# Altium schematic sheet 01_MAIN.SchDoc: =GlobalProjectName
size 594 x 420 mm; CheckedBy: A_D; Author: A_D; SheetNumber: 1; SheetTotal: 3; PageSetup: Record=PageOptions|CenterHorizontal=True|CenterVertical=True|PrintScale=0.70|XCorrection=1.00|YCorrection=1.00|PrintKind=2|BorderSize=5000000|LeftOffset=9000|BottomOffset=10100|Orientation=2|PaperLength=11176|PaperWidth=8636|Scale=100|PaperSource=259|PrintQuality=-3|MediaType=1|DitherType=10|PrintScaleMode=1|PaperKind=A3|PaperIndex=8
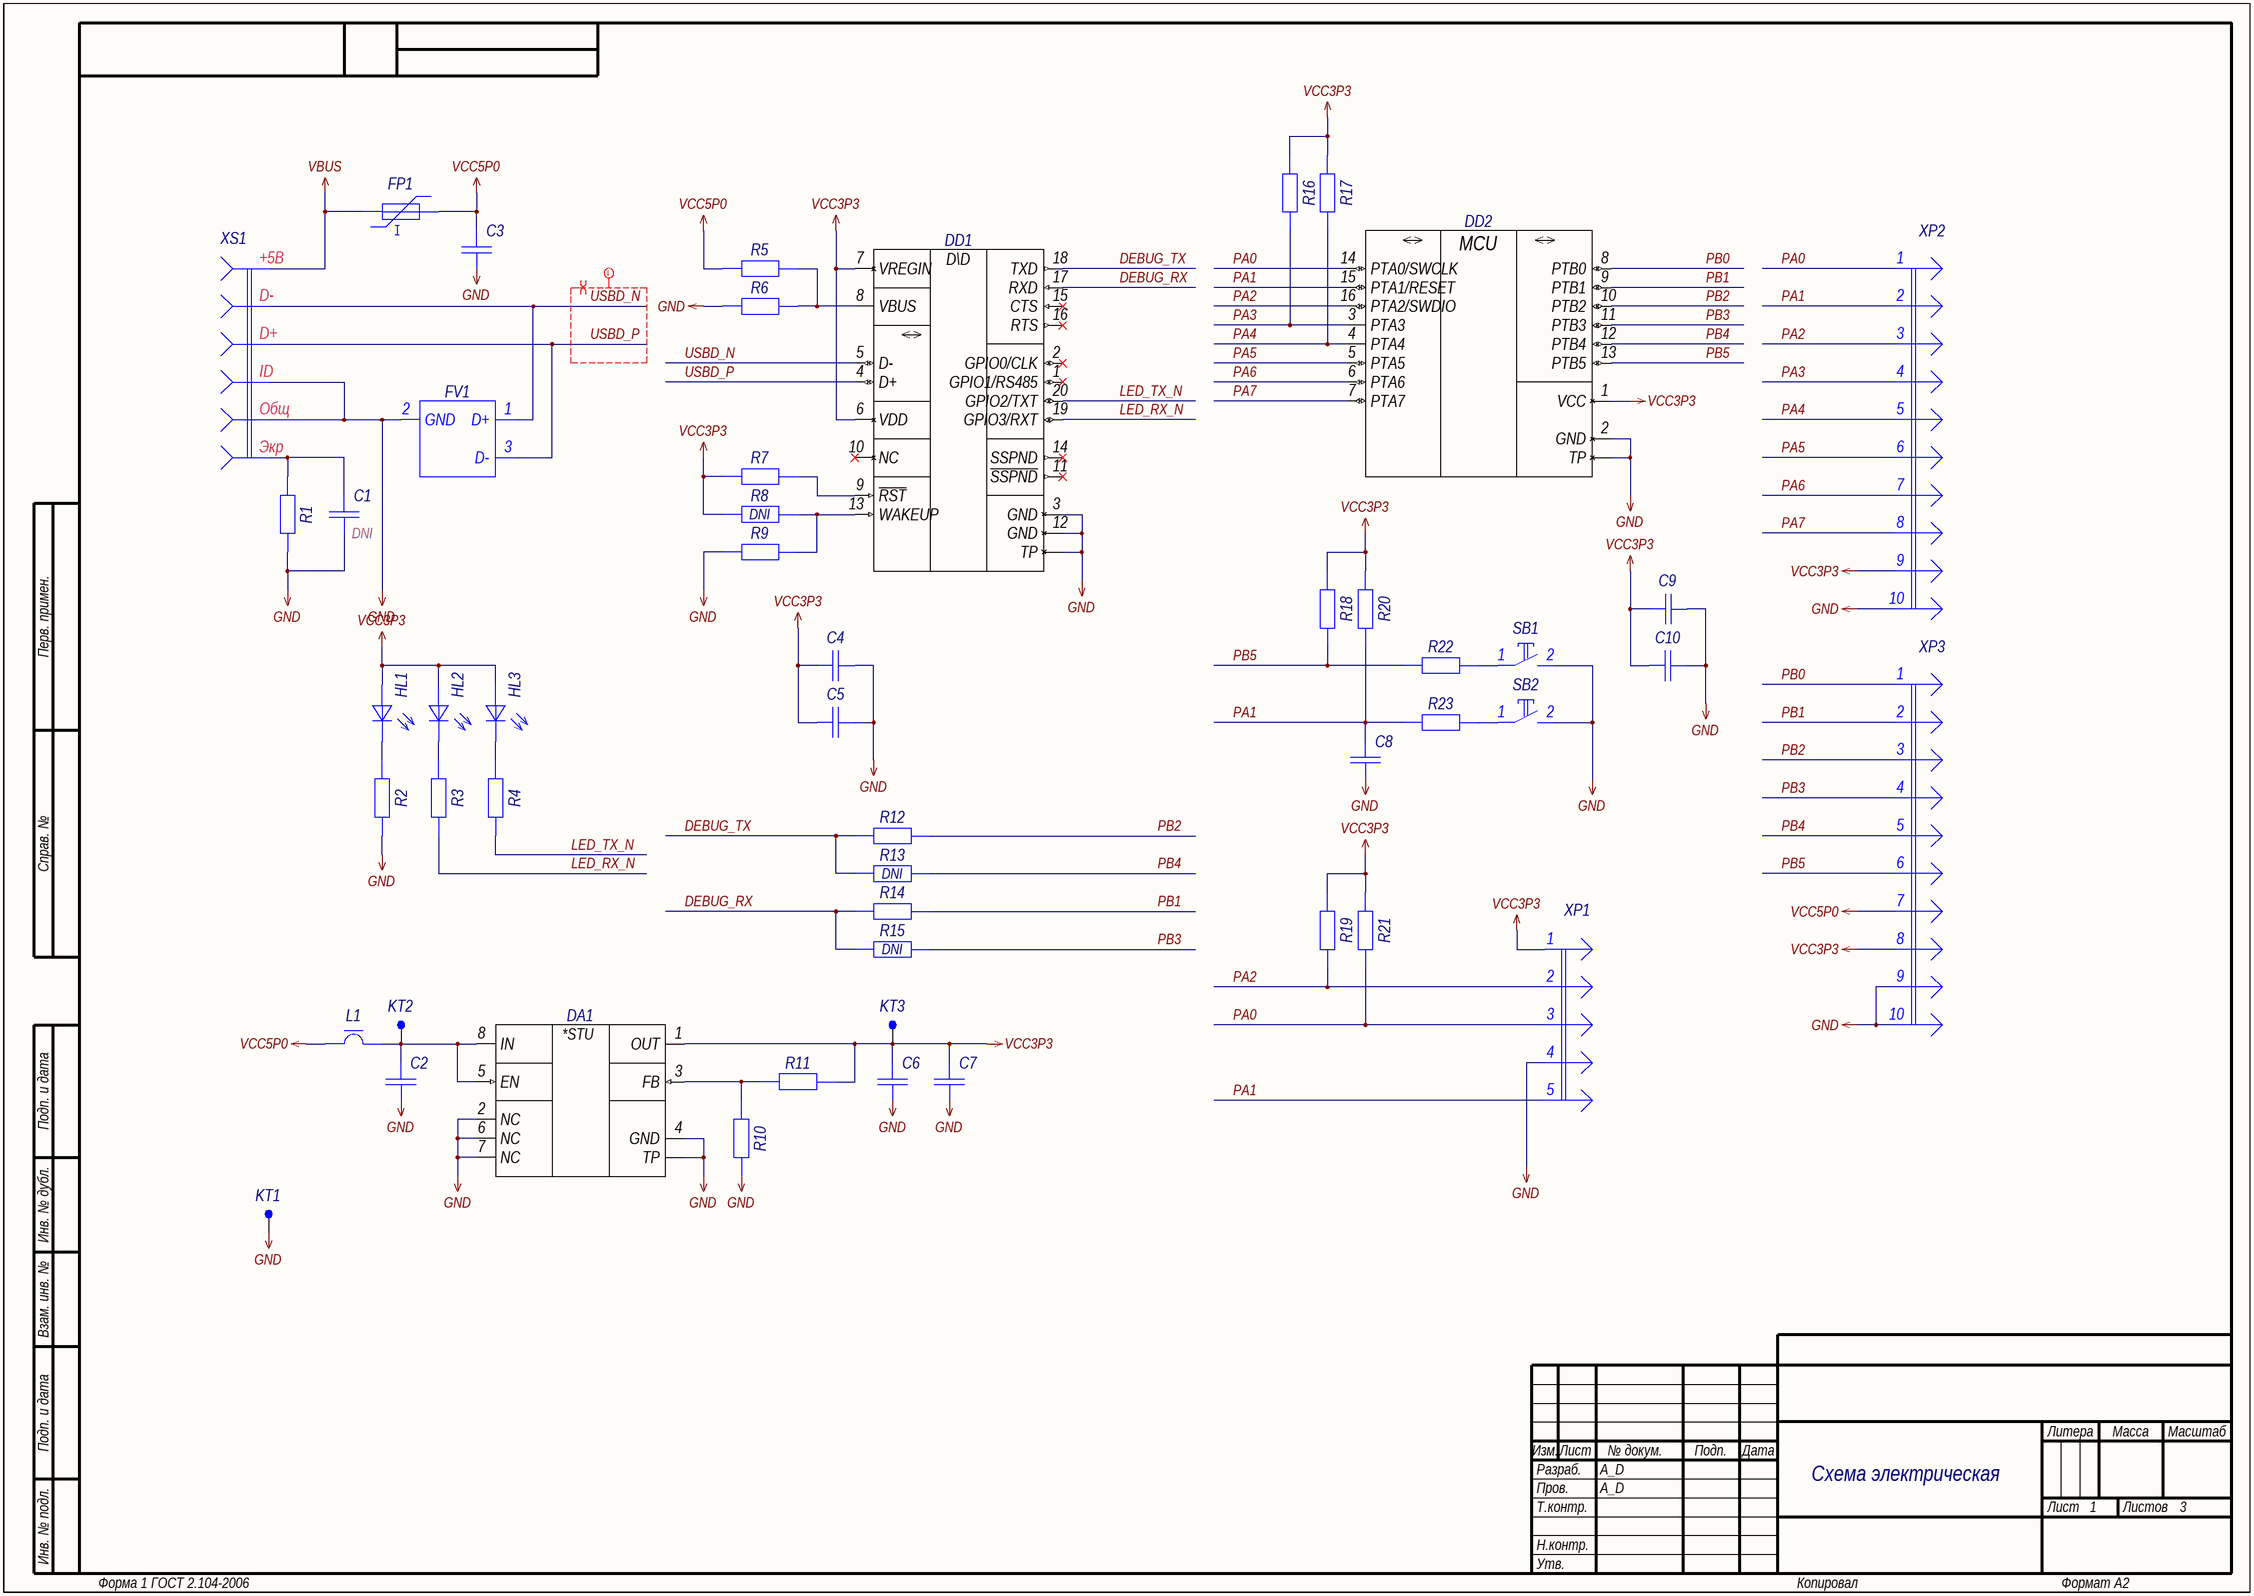
[diagram p0: 01_MAIN.SchDoc]

## Parts
C1  Capacitor  [C0603_L]  (value not drawn)  (no BOM)
C2  Capacitor  [C0402_L]  (value not drawn)
C3  Capacitor  [C0603_L]  (value not drawn)
C4  Capacitor  [C0402_L]  (value not drawn)
C5  Capacitor  [C0402_L]  (value not drawn)
C6  Capacitor  [C0402_L]  (value not drawn)
C7  Capacitor  [C0402_L]  (value not drawn)
C8  Capacitor  [C0402_L]  (value not drawn)
C9  Capacitor  [C0402_L]  (value not drawn)
C10  Capacitor  [C0402_L]  (value not drawn)
DA1  TPS73701DRB  [VSON-8_065P300X300X100_N]  (value not drawn)
DD1  CP2102N-xxx-GQFN20  [QFN-20_050P300X300X080_N]  (value not drawn)
DD2  MKL03ZxxVFG4-Series  [HUQFN-16_050P300X300X065_N]  (value not drawn)
FP1  Fuse_PTC  [F0603_L]  (value not drawn)
FV1  TPD2EUSB30DRT  [SOT-3_070P100X080X050_N]  (value not drawn)
HL1  (no value)  [LD0402_L]
HL2  (no value)  [LD0402_L]
HL3  (no value)  [LD0402_L]
KT1  Text  [TP-SMT-R-0.8mm]  (value not drawn)  (no BOM)
KT2  Text  [TP-SMT-C-0.5mm]  (value not drawn)  (no BOM)
KT3  Text  [TP-SMT-C-0.5mm]  (value not drawn)  (no BOM)
L1  FerriteBead  [L0402_L]  (value not drawn)
R1  Resistor  [R0603_L]  (value not drawn)
R2  Resistor  [R0402_L]  (value not drawn)
R3  Resistor  [R0402_L]  (value not drawn)
R4  Resistor  [R0402_L]  (value not drawn)
R5  Resistor  [R0402_L]  (value not drawn)
R6  Resistor  [R0402_L]  (value not drawn)
R7  Resistor  [R0402_L]  (value not drawn)
R8  Resistor  [R0402_L]  (value not drawn)  (no BOM)
R9  Resistor  [R0402_L]  (value not drawn)
R10  Resistor  [R0402_L]  (value not drawn)
R11  Resistor  [R0402_L]  (value not drawn)
R12  Resistor  [R0402_L]  (value not drawn)
R13  Resistor  [R0402_L]  (value not drawn)  (no BOM)
R14  Resistor  [R0402_L]  (value not drawn)
R15  Resistor  [R0402_L]  (value not drawn)  (no BOM)
R16  Resistor  [R0402_L]  (value not drawn)
R17  Resistor  [R0402_L]  (value not drawn)
R18  Resistor  [R0402_L]  (value not drawn)
R19  Resistor  [R0402_L]  (value not drawn)
R20  Resistor  [R0402_L]  (value not drawn)
R21  Resistor  [R0402_L]  (value not drawn)
R22  Resistor  [R0402_L]  (value not drawn)
R23  Resistor  [R0402_L]  (value not drawn)
SB1  RESET  [IT-1185AP]  (value not drawn)
SB2  NMI  [IT-1185AP]  (value not drawn)
XP1  Text  [PLS-5]  (value not drawn)
XP2  PA  [PLS-10]  (value not drawn)
XP3  PB  [PLS-10]  (value not drawn)
XS1  USB  [1981568-1]  (value not drawn)

## Nets
GND: C1.1 C2.1 C3.1 C4.1 C5.1 C6.1 C7.1 C8.2 C9.2 C10.1 DA1.2(NC) DA1.4(GND) DA1.6(NC) DA1.7(NC) DA1.TP DD1.3(GND) DD1.12(GND) DD1.TP DD2.2(GND) DD2.TP FV1.2(GND) KT1.1 R1.1 R2.1 R6.1 R9.1 R10.1 SB1.2 SB2.2 XP1.4 XP2.10 XP3.9 XP3.10 XS1.4 XS1.5
VBUS: FP1.1 XS1.1
VCC3P3: C4.2 C5.2 C6.2 C7.2 C9.1 C10.2 DA1.1(OUT) DD1.6(VDD) DD1.7(VREGIN) DD2.1(VCC) HL1.1(А) HL2.1(А) HL3.1(А) KT3.1 R7.2 R8.2 R11.2 R16.2 R17.2 R18.1 R19.1 R20.1 R21.1 XP1.1 XP2.9 XP3.8
VCC5P0: C3.2 FP1.2 L1.1 R5.1 XP3.7
DEBUG_RX: DD1.17(RXD) R14.1 R15.1
DEBUG_TX: DD1.18(TXD) R12.1 R13.1
LED_RX_N: DD1.19(GPIO3/RXT) R3.1
LED_TX_N: DD1.20(GPIO2/TXT) R4.1
PA0: DD2.14(PTA0/SWCLK) R21.2 XP1.3 XP2.1
PA1: C8.1 DD2.15(PTA1/RESET) R20.2 R23.1 XP1.5 XP2.2
PA2: DD2.16(PTA2/SWDIO) R19.2 XP1.2 XP2.3
PA3: DD2.3(PTA3) R16.1 XP2.4
PA4: DD2.4(PTA4) R17.1 XP2.5
PA5: DD2.5(PTA5) XP2.6
PA6: DD2.6(PTA6) XP2.7
PA7: DD2.7(PTA7) XP2.8
PB0: DD2.8(PTB0) XP3.1
PB1: DD2.9(PTB1) R14.2 XP3.2
PB2: DD2.10(PTB2) R12.2 XP3.3
PB3: DD2.11(PTB3) R15.2 XP3.4
PB4: DD2.12(PTB4) R13.2 XP3.5
PB5: DD2.13(PTB5) R18.2 R22.1 XP3.6
USBD_N: DD1.5(D-) FV1.1(D+) XS1.2
USBD_P: DD1.4(D+) FV1.3(D-) XS1.3
NetC1_2: C1.2 R1.2 XS1.6
NetC2_2: C2.2 DA1.5(EN) DA1.8(IN) KT2.1 L1.2
NetDA1_3: DA1.3(FB) R10.2 R11.1
NetDD1_8: DD1.8(VBUS) R5.2 R6.2
NetDD1_9: DD1.9(~{RST}) R7.1
NetDD1_13: DD1.13(WAKEUP) R8.1 R9.2
NetHL1_2: HL1.2(К) R2.2
NetHL2_2: HL2.2(К) R3.2
NetHL3_2: HL3.2(К) R4.2
NetR22_2: R22.2 SB1.1
NetR23_2: R23.2 SB2.1

Not connected (* = marked no-connect by the designer): DD1 1(GPIO1/RS485)* 2(GPIO0/CLK)* 10(NC)* 11(~{SSPND})* 14(SSPND)* 15(CTS)* 16(RTS)*

## Layout directives
differential pair; differential pair class USB: USBD_N, USBD_P
rule Matched Net Lengths [Tolerance = 1mm]: USBD_N, USBD_P

## Notes on the sheet
- (near C1) DNI
- (near R8) DNI
- (near R13) DNI
- (near R15) DNI
- Схема электрическая
  принципиальная
- Перв. примен.
- Справ. №
- Подп. и дата
- Инв. № дубл.
- Взам. инв. №
- Разраб.
- Изм.
- Лист
- № докум.
- Подп.
- Дата
- Литера
- Масса
- Масштаб
- Пров.
- Т.контр.
- Листов
- Инв. № подл.
- Н.контр.
- Утв.
- Форма 1 ГОСТ 2.104-2006
- Копировал
- Формат А2
- (in symbol 1981568-1) +5В; D-; D+; ID; Общ; Экр
- (in symbol CP2102N-A01-GQFN20) D\D
- (in symbol MKL03Z8VFG4) MCU
- (in symbol TPS73701DRBR) *STU

## Library data of the parts
C1 = GRM188R72A104KA35D: Manufacturer: Murata; Type: Конденсатор; ID: 232; Value: 0.1uF; Voltage: 100V; Tolerance: ±10%; Dielectric Type: X7R; Application Category: 1; Working Temperature Min: -55°С; Working Temperature Max: +125°С; Published: 18.05.2010; Publisher: Andrew Danich; Part Number: GRM188R72A104KA35D; Footprint: 0603; ClassName: DirectConnect
C2 C4-C7 = GRM155R60J475ME87D: Manufacturer: Murata; Type: Конденсатор; ID: 223; Value: 4.7uF; Voltage: 6.3V; Tolerance: ±20%; Dielectric Type: X5R; Application Category: 1; Working Temperature Min: -55°С; Working Temperature Max: +85°С; Published: 18.05.2010; Publisher: Andrew Danich; Part Number: GRM155R60J475ME87D; Footprint: 0402; ClassName: DirectConnect
C3 = GRM188R60J106ME47D: Manufacturer: Murata; Type: Конденсатор; ID: 136; Value: 10uF; Voltage: 6.3V; Tolerance: ±20%; Dielectric Type: X5R; Application Category: 1; Working Temperature Min: -55°С; Working Temperature Max: +85°С; Published: 18.05.2010; Publisher: Andrew Danich; Part Number: GRM188R60J106ME47D; Footprint: 0603; ClassName: DirectConnect
C8 C10 = GCM155R71C104KA55D: Manufacturer: Murata; Type: Конденсатор; ID: 163; Value: 0.1uF; Voltage: 16V; Tolerance: ±10%; Dielectric Type: X7R; Application Category: 1; Working Temperature Min: -55°С; Working Temperature Max: +125°С; Functional Analog: GRM155R71C104KA88D; Published: 18.05.2010; Publisher: Andrew Danich; Part Number: GCM155R71C104KA55D; Footprint: 0402
C9 = GRM155C71A105KE11D: Manufacturer: Murata; Type: Конденсатор; ID: 179; Value: 1uF; Voltage: 10V; Tolerance: ±10%; Dielectric Type: X7S; Application Category: 1; Working Temperature Min: -55°С; Working Temperature Max: +125°С; Published: 18.05.2010; Publisher: Andrew Danich; Part Number: GRM155C71A105KE11D; Footprint: 0402
DA1 = TPS73701DRBR: Manufacturer: Texas Instruments; ID: 26; Input Voltage: +2.2…5.5V; Output Current: 1A; Output Voltage: +1.2…5.5V; Application Category: 1; Working Temperature Min: -40°С; Working Temperature Max: +125°С; Functional Analog: TPS73701DRBT; Published: 25.03.2019; Publisher: Andrew Danich; Type: Микросхема; Part Number: TPS73701DRBR; Value: TPS73701DRBR; ClassName: DirectConnect
DD1 = CP2102N-A01-GQFN20: Manufacturer: Silicon Labs; ID: 14; Supply Operation: +3.0…3.6V; Supply Current: 13.7mA; USB Type Support: USB 2.0; USB Speed Support: 12 Mb/s; OTG Support: No; Input Interface: UART; Channels: 1; Working Temperature Min: -40°C; Working Temperature Max: +85°C; Functional Analog: CP2102N-A02-GQFN20; Published: 16.07.2019; Publisher: Andrew Danich; Type: Микросхема; Part Number: CP2102N-A01-GQFN20; Value: CP2102N-A01-GQFN20; Application Category: 1
DD2 = MKL03Z8VFG4: Manufacturer: NXP Semiconductors; ID: 29; Supply Operation: +1.71…3.6V; Flash: 8K; SRAM: 2K; Prog Interface: SWD; I/O Lines: 14; Operation Frequency: 48MHz; Application Category: 1; Working Temperature Min: -40°С; Working Temperature Max: +105°С; Published: 16.07.2019; Publisher: Andrew Danich; Type: Микросхема; Part Number: MKL03Z8VFG4; Value: MKL03Z8VFG4; EEPROM: -
FP1 = 0603L100SLYR: Manufacturer: Littelfuse; ID: 13; Limit Voltage: 6V; Rated Current: 1A; Resistance: 0.12ohm; Application Category: 1; Working Temperature Min: -40°С; Working Temperature Max: +85°С; Published: 25.0.2017; Value: 0603L100SLYR; Type: Предохранитель самовосстанавливающийся; Part Number: 0603L100SLYR; Footprint: F0603; Functional Analog: -; ClassName: DirectConnect
FV1 = TPD2EUSB30DRT: Manufacturer: Texas Instruments; ID: 5; Breakdown Voltage: 7V; Reverse Stand Off Voltage: 5.5V; Forward Voltage: 0.95V; Peak Forward Current: 5A; Junction Capacitance: 0.8pF; Pulse Power Dissipation: 45W; Directional: Bidirectional; Application Category: 1; Working Temperature Min: -40°С; Working Temperature Max: +85°С; Published: 27.12.2015; Publisher: Andrew Danich; Type: Супрессор; Part Number: TPD2EUSB30DRT; Value: TPD2EUSB30DRT; Functional Analog: -
HL1 = KPHHS-1005QBC-D-V: Manufacturer: Kingbright; Type: Индикатор единичный; ID: 24; Forward Voltage: 3.3V; Forward Current: 20mA; Power Dissipation: 120mW; Luminous Flux: 60; Color: Blue; Leds: 1; Working Temperature Min: -40°С; Working Temperature Max: +85°С; Published: 03.12.2013; Publisher: Andrew Danich; Part Number: KPHHS-1005QBC-D-V; Value: KPHHS-1005QBC-D-V; Footprint: 0402; Application Category: 1
HL2 = KPHHS-1005CGCK: Manufacturer: Kingbright; Type: Индикатор единичный; ID: 25; Forward Voltage: 2.1V; Forward Current: 20mA; Power Dissipation: 75mW; Luminous Flux: 60; Color: Green; Leds: 1; Working Temperature Min: -40°С; Working Temperature Max: +85°С; Published: 03.12.2013; Publisher: Andrew Danich; Part Number: KPHHS-1005CGCK; Value: KPHHS-1005CGCK; Footprint: 0402; Application Category: 1
HL3 = KPHHS-1005SURCK: Manufacturer: Kingbright; Type: Индикатор единичный; ID: 35; Forward Voltage: 2.5V; Forward Current: 20mA; Power Dissipation: 75mW; Luminous Flux: 140; Color: Red; Leds: 1; Working Temperature Min: -40°С; Working Temperature Max: +85°С; Published: 03.12.2013; Publisher: Andrew Danich; Part Number: KPHHS-1005SURCK; Value: KPHHS-1005SURCK; Footprint: 0402; Application Category: 1
KT1 = TestPoint-SMT-GND: ID: 7; Application Type: On PCB Test Point; Application Category: 1; Published: 03.03.2015; Publisher: Andrew Danich; Part Number: TestPoint-SMT-GND; Value: TestPoint-SMT; Manufacturer: -; Functional Analog: -
KT2 KT3 = TestPoint-SMT: ID: 6; Application Type: On PCB Test Point; Application Category: 1; Published: 03.03.2015; Publisher: Andrew Danich; Part Number: TestPoint-SMT; Value: TestPoint-SMT; Manufacturer: -; Functional Analog: -
L1 = BLM15PD121SN1D: Manufacturer: Murata; Type: Дроссель; ID: 11; Rated Current: 1.3A; Impedance at 100Mhz: 120ohm; Tolerance: ±25%; DC Resistance: 0.09ohm; Inductor Type: EMIFIL; Application Category: 1; Working Temperature Min: -55°С; Working Temperature Max: +125°С; Published: 14.11.2014; Publisher: Andrew Danich; Part Number: BLM15PD121SN1D; Value: BLM15PD121SN1D; Footprint: 0402; ClassName: DirectConnect
R1 = RC0603JR-070R: Manufacturer: Yageo; ID: 5; Value: 0; Limit Voltage: 50V; Tolerance: ±5%; Temperature Coefficient: 100ppm; Total Power Dissipation: 0.1W; Series Type: Thick-Film; Application Category: 1; Working Temperature Min: -55°С; Working Temperature Max: +155°С; Functional Analog: RC0603FR-070RL, CR0603-J/-000E; Published: 24.03.2010; Publisher: Andrew Danich; Type: Резистор; Part Number: RC0603JR-070R; Footprint: 0603; ClassName: DirectConnect
R2-R4 = RC0402JR-071KL: Manufacturer: Yageo; ID: 3; Value: 1k; Limit Voltage: 50V; Tolerance: ±5%; Temperature Coefficient: 100ppm; Total Power Dissipation: 0.1W; Series Type: Thick-Film; Application Category: 1; Working Temperature Min: -55°С; Working Temperature Max: +155°С; Published: 24.03.2010; Publisher: Andrew Danich; Type: Резистор; Part Number: RC0402JR-071KL; Footprint: 0402
R5 R11 = RC0402FR-0722K1L: Manufacturer: Yageo; ID: 447; Value: 22.1k; Limit Voltage: 50V; Tolerance: ±1%; Temperature Coefficient: 100ppm; Total Power Dissipation: 0.1W; Series Type: Thick-Film; Application Category: 1; Working Temperature Min: -55°С; Working Temperature Max: +155°С; Published: 24.03.2010; Publisher: Andrew Danich; Type: Резистор; Part Number: RC0402FR-0722K1L; Footprint: 0402
R6 = RC0402FR-0747KL: Manufacturer: Yageo; ID: 528; Value: 47k; Limit Voltage: 50V; Tolerance: ±1%; Temperature Coefficient: 100ppm; Total Power Dissipation: 0.1W; Series Type: Thick-Film; Application Category: 1; Working Temperature Min: -55°С; Working Temperature Max: +155°С; Published: 24.03.2010; Publisher: Andrew Danich; Type: Резистор; Part Number: RC0402FR-0747KL; Footprint: 0402
R7 R8 R18-R21 = RC0402JR-0710KL: Manufacturer: Yageo; ID: 476; Value: 10k; Limit Voltage: 50V; Tolerance: ±5%; Temperature Coefficient: 100ppm; Total Power Dissipation: 0.1W; Series Type: Thick-Film; Application Category: 1; Working Temperature Min: -55°С; Working Temperature Max: +155°С; Published: 24.03.2010; Publisher: Andrew Danich; Type: Резистор; Part Number: RC0402JR-0710KL; Footprint: 0402
R9 R12-R15 = RC0402JR-070RL: Manufacturer: Yageo; ID: 362; Value: 0; Limit Voltage: 50V; Tolerance: ±5%; Temperature Coefficient: 100ppm; Total Power Dissipation: 0.1W; Series Type: Thick-Film; Application Category: 1; Working Temperature Min: -55°С; Working Temperature Max: +155°С; Published: 24.03.2010; Publisher: Andrew Danich; Type: Резистор; Part Number: RC0402JR-070RL; Footprint: 0402
R10 = RC0402FR-0712KL: Manufacturer: Yageo; ID: 318; Value: 12k; Limit Voltage: 50V; Tolerance: ±1%; Temperature Coefficient: 100ppm; Total Power Dissipation: 0.1W; Series Type: Thick-Film; Application Category: 1; Working Temperature Min: -55°С; Working Temperature Max: +155°С; Published: 24.03.2010; Publisher: Andrew Danich; Type: Резистор; Part Number: RC0402FR-0712KL; Footprint: 0402
R16 R17 = RC0402JR-074K7L: Manufacturer: Yageo; ID: 4; Value: 4.7k; Limit Voltage: 50V; Tolerance: ±5%; Temperature Coefficient: 100ppm; Total Power Dissipation: 0.1W; Series Type: Thick-Film; Application Category: 1; Working Temperature Min: -55°С; Working Temperature Max: +155°С; Published: 24.03.2010; Publisher: Andrew Danich; Type: Резистор; Part Number: RC0402JR-074K7L; Footprint: 0402
R22 R23 = RC0402JR-07100RL: Manufacturer: Yageo; ID: 479; Value: 100; Limit Voltage: 50V; Tolerance: ±5%; Temperature Coefficient: 100ppm; Total Power Dissipation: 0.1W; Series Type: Thick-Film; Application Category: 1; Working Temperature Min: -55°С; Working Temperature Max: +155°С; Published: 24.03.2010; Publisher: Andrew Danich; Type: Резистор; Part Number: RC0402JR-07100RL; Footprint: 0402
SB1 SB2 = IT-1185AP: ID: 36; Limit Current: 50mA; Resistance: 0.1ohm; Isolator Resistance: 100meg; Backlight: NO; Number of Contacts: 2; Application Category: 1; Published: 17.04.2014; Publisher: Andrew Danich; Type: Переключатель; Part Number: IT-1185AP; Value: IT-1185AP; Height: 5mm
XP1 = PLS-5: Value: PLS-5; ID: 4; Limit Voltage: 250V; Limit Current: 3A; Connector Type: Male; Resistance: 15momh; Surface Finish: Gold; Pitch: 2.54mm; Application Category: 1; Published: 07.03.2013; Publisher: Andrew Danich; Type: Вилка; Part Number: PLS-5; Pins: 5
XP2 XP3 = PLS-10: Value: PLS-10; ID: 9; Limit Voltage: 250V; Limit Current: 3A; Connector Type: Male; Resistance: 15momh; Surface Finish: Gold; Pitch: 2.54mm; Application Category: 1; Published: 07.03.2013; Publisher: Andrew Danich; Type: Вилка; Part Number: PLS-10; Pins: 10
XS1 = 1981568-1: Manufacturer: TE Connectivity; ID: 30; Limit Voltage: 24V; Limit Current: 1A; Connector Type: Female; Interface: USB 2.0; Max Data Rate: 480 mbps; Application Category: 1; Published: 11.04.2016; Publisher: Andrew Danich; Type: Розетка; Part Number: 1981568-1; Value: 1981568-1; Pins: 9; Mount Type: Surface; ClassName: DirectConnect